# Altium project LiOnChargerShield.PrjPcb
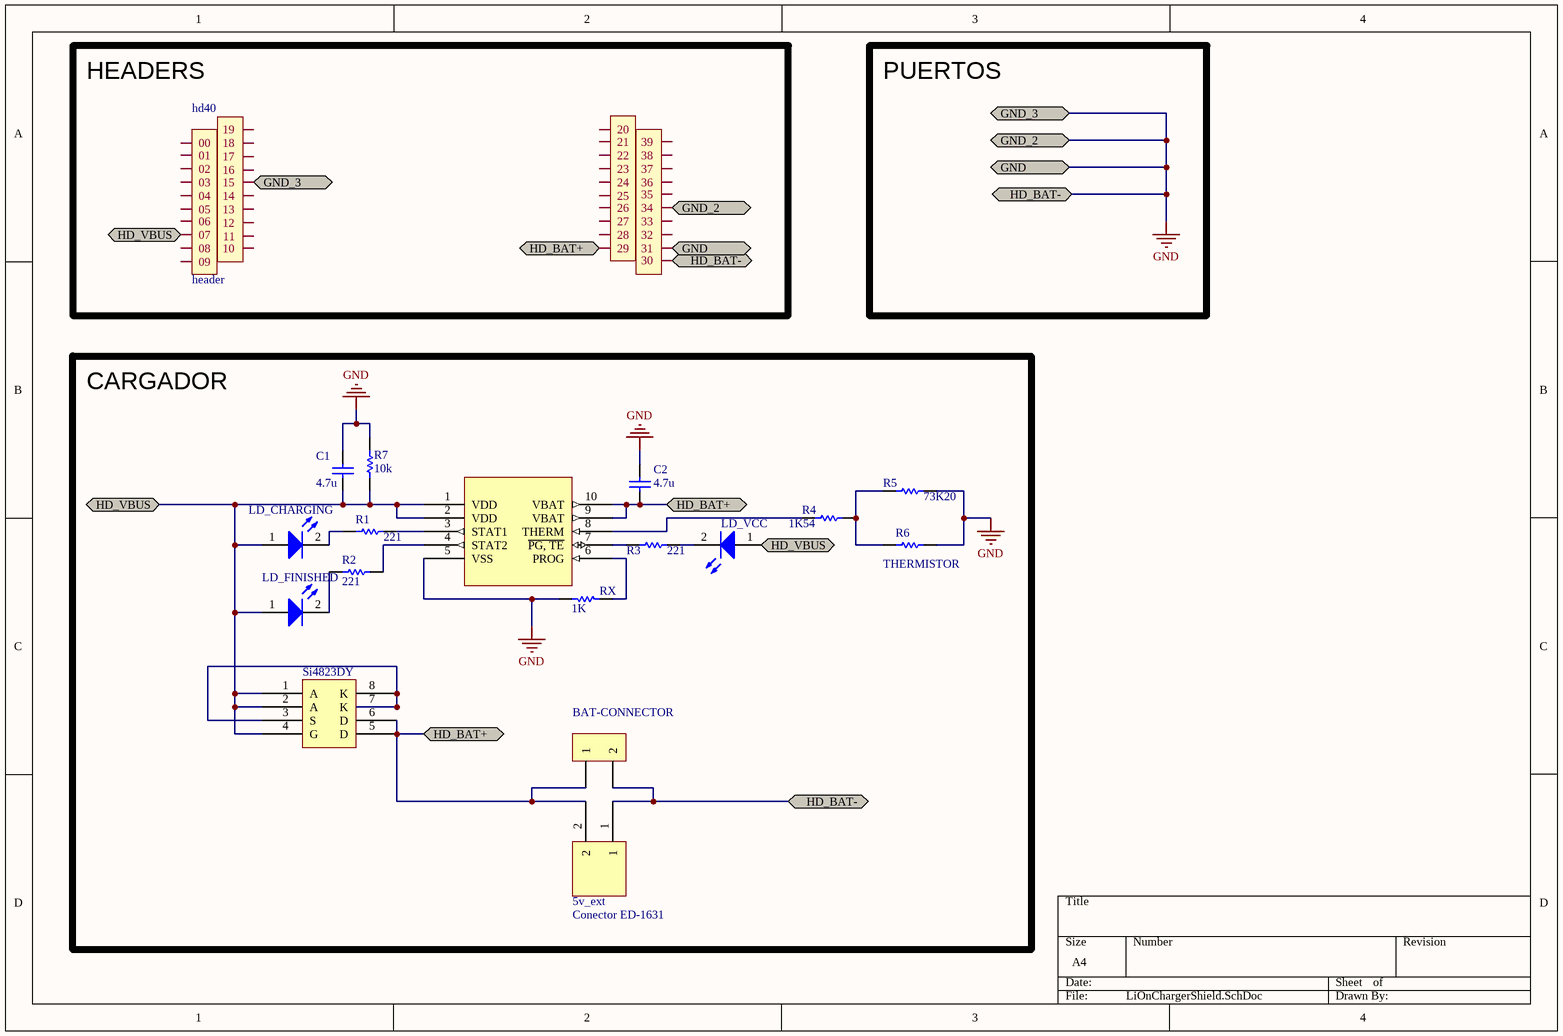
[diagram p0: LiOnChargerShield.SchDoc]
1 sheet, 18 parts. Net scope: flat (ports and power ports of the same name join across sheets).
Board file: LiOnChargerShield.PcbDoc

## Sheet LiOnChargerShield.SchDoc
size A4

### Parts
5v_ext  Conector ED-1631  [Conector ED-1631]
BAT-CONNECTOR  Header-1x2  [B2B-PH-K-S]  (value not drawn)
C1  value 4.7u  [0603 Cap]  (hidden comment: Cap)
C2  value 4.7u  [0603 Cap]  (hidden comment: Cap)
hd40  header  [header_cognitiveNGD]
LD_CHARGING  LED  [0603 LED-Green]  (value not drawn)
LD_FINISHED  LED  [0603 LED-BLUE]  (value not drawn)
LD_VCC  LED  [0603 LED-RED]  (value not drawn)
MCP73833  Stand-Alone Linear Li-Ion / Li-Polymer Charge  Management Controller  [MCP73833/4]  (value not drawn)
R1  value 221  [0603 Res]  (hidden comment: Res)
R2  221  [0603 Res]
R3  value 221  [0603 Res]  (hidden comment: Res)
R4  value 1K54  [0603 Res]  (hidden comment: Res)
R5  value 73K20  [0603 Res]  (hidden comment: Res)
R6  value THERMISTOR  [0805 Res]  (hidden comment: Res)
R7  value 10k  [0603 Res]  (hidden comment: Res)
RX  value 1K  [0603 Res]  (hidden comment: Res)
Si4823DY  Si4823DY  [Si4823DY]  (value not drawn)

### Blocks framed on the sheet
HEADERS: hd40
CARGADOR: 5v_ext BAT-CONNECTOR C1 C2 LD_CHARGING LD_FINISHED LD_VCC MCP73833 R1-R7 RX Si4823DY

### Ports
GND, GND_2, GND_3, HD_BAT+, HD_BAT-, HD_VBUS

### Nets
GND: 5v_ext.1 BAT-CONNECTOR.2 C1.2 C2.2 hd40.15 hd40.30 hd40.31 hd40.34 MCP73833.5(VSS) R5.2 R6.2 R7.2 RX.2 ; port HD_BAT-, port GND, port GND_3, port GND_2
Net5v_ext_2: 5v_ext.2 BAT-CONNECTOR.1 C2.1 hd40.29 MCP73833.9(VBAT) MCP73833.10(VBAT) Si4823DY.5(D) Si4823DY.6(D) ; port HD_BAT+
NetC1_1: C1.1 hd40.07 LD_CHARGING.1(A) LD_FINISHED.1(A) LD_VCC.1(A) MCP73833.1(VDD) MCP73833.2(VDD) R7.1 Si4823DY.1(A) Si4823DY.2(A) Si4823DY.4(G) ; port HD_VBUS
NetLD_CHARGING_2: LD_CHARGING.2(C) R1.1
NetLD_FINISHED_2: LD_FINISHED.2(C) R2.1
NetLD_VCC_2: LD_VCC.2(C) R3.2
NetMCP73833_3: MCP73833.3(STAT1) R1.2
NetMCP73833_4: MCP73833.4(STAT2) R2.2
NetMCP73833_6: MCP73833.6(PROG) RX.1
NetMCP73833_7: MCP73833.7(~{PG,_TE}) R3.1
NetMCP73833_8: MCP73833.8(THERM) R4.1
NetR4_2: R4.2 R5.1 R6.1
NetSi4823DY_3: Si4823DY.3(S) Si4823DY.7(K) Si4823DY.8(K)

Not connected (* = marked no-connect by the designer): hd40 00 01 02 03 04 05 06 08 09 10 11 12 13 14 16 17 18 19 20 21 22 23 24 25 26 27 28 32 33 35 36 37 38 39

### Notes on the sheet
- PUERTOS

### Library data of the parts
5v_ext = Conector ED-1631: Terminal Block 2 vías, 5mm
hd40 = header_cognitiveNGD
MCP73833 = MCP73833: Supplier 1: Digi-Key
R2 = Res: Value: 221
Si4823DY = Si4823DY: Supplier 1: Mouser; Supplier Part Number 1: 781-SI4823DY-T1-GE3